# EAGLE design Subsystem (EAGLE 7.6.0)
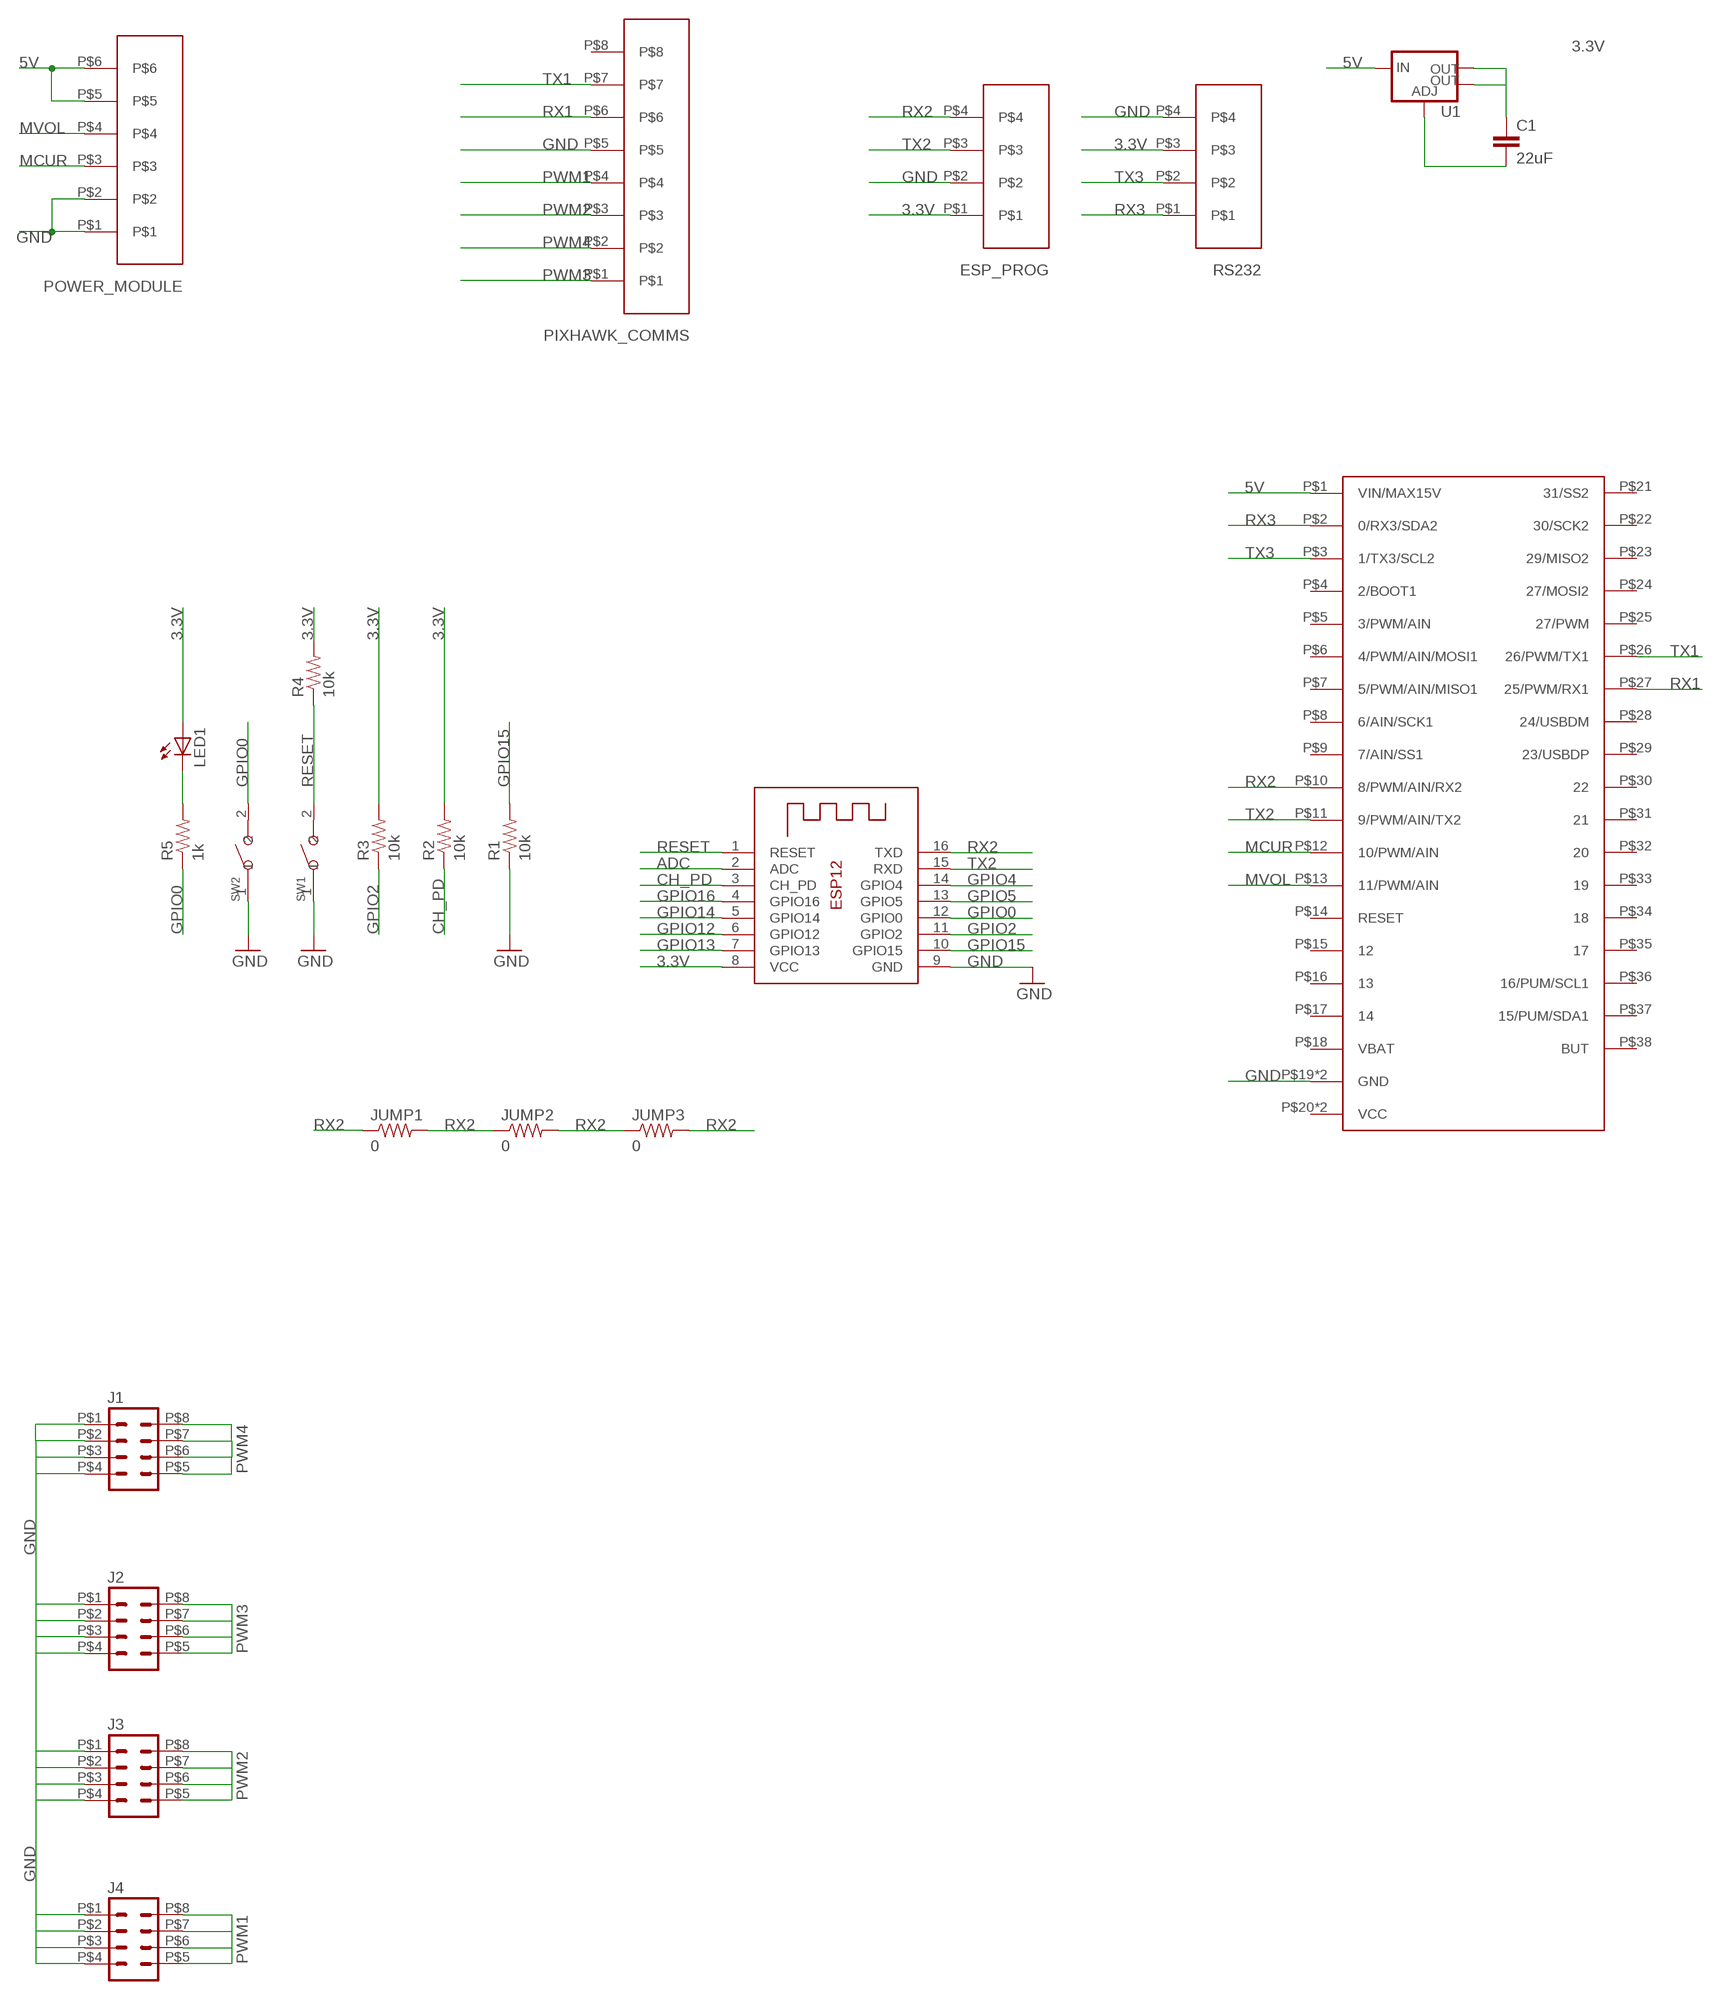
[diagram p0: schematic, sheet 1]

## Parts
C1  22uF  CAP0805  [0805]
ESP_PROG  4PIN-PLUG  [4PIN-PLUG]
J1  M04X2  [2X4]
J2  M04X2  [2X4]
J3  M04X2  [2X4]
J4  M04X2  [2X4]
JUMP1  0  RESISTOR1206  [1206]
JUMP2  0  RESISTOR1206  [1206]
JUMP3  0  RESISTOR1206  [1206]
LED1  LED1206  [LED-1206]
PIXHAWK_COMMS  8PIN-PLUG  [8PIN-PLUG]
POWER_MODULE  6PIN-PLUG  [6PIN-PLUG]
R1  10k  RESISTOR0805-RES  [0805]
R2  10k  RESISTOR0805-RES  [0805]
R3  10k  RESISTOR0805-RES  [0805]
R4  10k  RESISTOR0805-RES  [0805]
R5  1k  RESISTOR0805-RES  [0805]
RS232  4PIN-PLUG  [4PIN-PLUG]
SW1  SMD-BUTTON(2P-6.0X3.0X2.5MM)-DHT-1163S  [SW2-4.0-6.0X3.0X2.5MM]
SW2  SMD-BUTTON(2P-6.0X3.0X2.5MM)-DHT-1163S  [SW2-4.0-6.0X3.0X2.5MM]
U1  V_REG_LM1117SOT223  [SOT223]
U$1  MAPLE-MINI  [MAPLE-MINI]
X1  ESP-12  [ESP-12]

## Nets
3.3V: C1.1 ESP_PROG.P$1 LED1.A R2.2 R3.2 R4.2 RS232.P$3 U1.2(OUT) U1.4(OUT) X1.8(VCC)
5V: POWER_MODULE.P$5 POWER_MODULE.P$6 U1.3(IN) U$1.P$1(VIN/MAX15V)
ADC: X1.2(ADC)
CH_PD: R2.1 X1.3(CH_PD)
GND: C1.2 ESP_PROG.P$2 J1.P$1 J1.P$2 J1.P$3 J1.P$4 J2.P$1 J2.P$2 J2.P$3 J2.P$4 J3.P$1 J3.P$2 J3.P$3 J3.P$4 J4.P$1 J4.P$2 J4.P$3 J4.P$4 PIXHAWK_COMMS.P$5 POWER_MODULE.P$1 POWER_MODULE.P$2 R1.1 RS232.P$4 SW1.1 SW2.1 U1.1(ADJ) U$1.P$19(GND) U$1.P$39(GND) X1.9(GND)
GPIO0: R5.1 SW2.2 X1.12(GPIO0)
GPIO2: R3.1 X1.11(GPIO2)
GPIO4: X1.14(GPIO4)
GPIO5: X1.13(GPIO5)
GPIO12: X1.6(GPIO12)
GPIO13: X1.7(GPIO13)
GPIO14: X1.5(GPIO14)
GPIO15: R1.2 X1.10(GPIO15)
GPIO16: X1.4(GPIO16)
MCUR: POWER_MODULE.P$3 U$1.P$12(10/PWM/AIN)
MVOL: POWER_MODULE.P$4 U$1.P$13(11/PWM/AIN)
N$4: LED1.C R5.2
PWM1: J4.P$5 J4.P$6 J4.P$7 J4.P$8 PIXHAWK_COMMS.P$4
PWM2: J3.P$5 J3.P$6 J3.P$7 J3.P$8 PIXHAWK_COMMS.P$3
PWM3: J2.P$5 J2.P$6 J2.P$7 J2.P$8 PIXHAWK_COMMS.P$1
PWM4: J1.P$5 J1.P$6 J1.P$7 J1.P$8 PIXHAWK_COMMS.P$2
RESET: R4.1 SW1.2 X1.1(RESET)
RX1: PIXHAWK_COMMS.P$6 U$1.P$27(25/PWM/RX1)
RX2: ESP_PROG.P$4 JUMP1.1 JUMP1.2 JUMP2.1 JUMP2.2 JUMP3.1 JUMP3.2 U$1.P$10(8/PWM/AIN/RX2) X1.16(TXD)
RX3: RS232.P$1 U$1.P$2(0/RX3/SDA2)
TX1: PIXHAWK_COMMS.P$7 U$1.P$26(26/PWM/TX1)
TX2: ESP_PROG.P$3 U$1.P$11(9/PWM/AIN/TX2) X1.15(RXD)
TX3: RS232.P$2 U$1.P$3(1/TX3/SCL2)
Unconnected: PIXHAWK_COMMS.P$8 U$1.P$4(2/BOOT1) U$1.P$5(3/PWM/AIN) U$1.P$6(4/PWM/AIN/MOSI1) U$1.P$7(5/PWM/AIN/MISO1) U$1.P$8(6/AIN/SCK1) U$1.P$9(7/AIN/SS1) U$1.P$14(RESET) U$1.P$15 U$1.P$16 U$1.P$17 U$1.P$18(VBAT) U$1.P$20(VCC) U$1.P$21(31/SS2) U$1.P$22(30/SCK2) U$1.P$23(29/MISO2) U$1.P$24(27/MOSI2) U$1.P$25(27/PWM) U$1.P$28(24/USBDM) U$1.P$29(23/USBDP) U$1.P$30 U$1.P$31 U$1.P$32 U$1.P$33 U$1.P$34 U$1.P$35 U$1.P$36(16/PUM/SCL1) U$1.P$37(15/PUM/SDA1) U$1.P$38(BUT) U$1.P$40(VCC)

## Library data of the parts
C1 = Brendan:CAP: Capacitor Standard 0603 ceramic capacitor, and 0.1" leaded capacitor.
ESP_PROG RS232 = Brendan:4PIN-PLUG
J1-J4 = Brendan:M04X2: .1" header, two rows of four.
JUMP1-JUMP3 R1-R5 = Brendan:RESISTOR: Resistor Basic schematic elements and footprints for 0603, 1206, and PTH resistors.
LED1 = Brendan:LED: LEDs Standard schematic elements and footprints for 5mm, 3mm, 1206, and 0603 sized LEDs. 5mm - Spark Fun Electronics SKU : Comp-SBL
PIXHAWK_COMMS = Brendan:8PIN-PLUG
POWER_MODULE = Brendan:6PIN-PLUG
SW1 SW2 = Brendan:SMD-BUTTON(2P-6.0X3.0X2.5MM): 311020029
U1 = Brendan:V_REG_LM1117: Voltage Regulator LM1117 Standard adjustable voltage regulator but in SMD form. Spark Fun Electronics SKU : COM-00595; PROD_ID: VREG-08170
U$1 = Brendan:MAPLE-MINI
X1 = Brendan:ESP-12

## Board
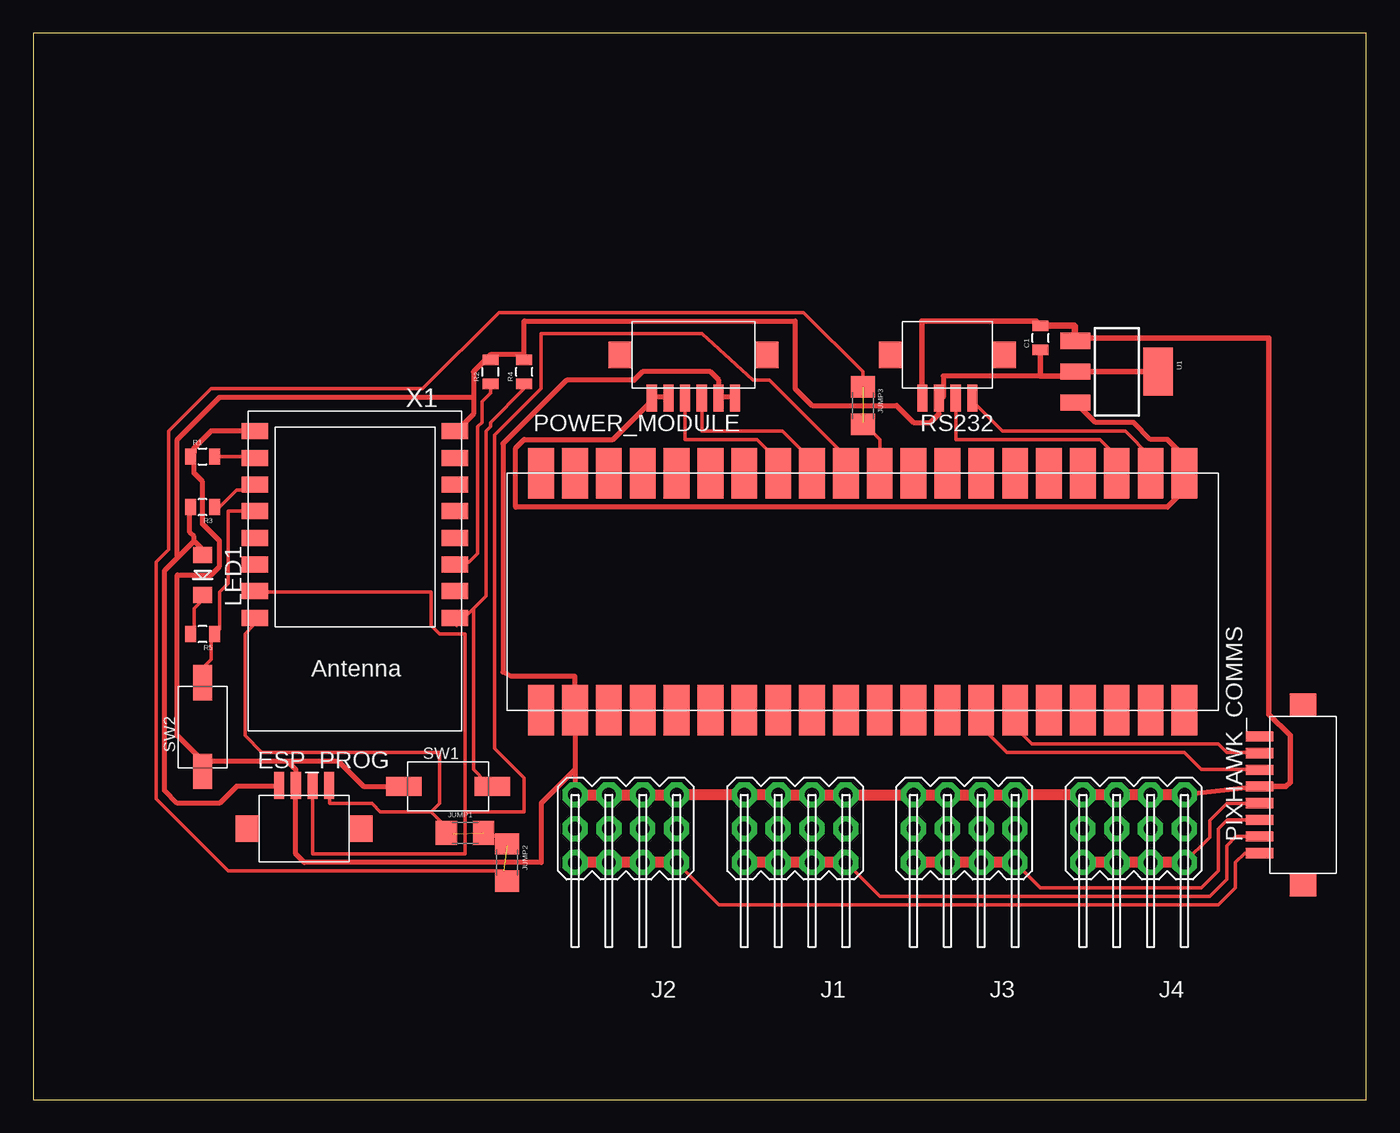
[diagram p1: board, top side]

Size 100 x 80 mm. Coordinates in mm from the lower left corner, seen from the top.
Outline: 0,0 100,0 100,80 0,80 0,0
Copper layers (1*16): Top 0.035mm / dielectric 1.5mm / Bottom 0.035mm
Design rules "default *": minimum track width 10mil, minimum drill 24mil, track to track 11mil, track to pad 11mil, pad to pad 11mil, via to via 11mil, smd to smd 8mil, copper to edge 40mil, drill to drill 8mil, minimum pad ring 10mil, minimum via ring 8mil, stop-mask expansion 4mil, vias tented up to drill 0mil, thermal gap 10mil

### Footprints (pad centres in the part's own frame; a part is rotated, then mirrored left to right if it is on the bottom)
0805 = smd 0.8 x 1.2: 1 -0.9,0; 2 0.9,0
4PIN-PLUG = smd 0.762 x 2.032: P$1 -1.875,3.25; P$2 -0.625,3.25; P$3 0.625,3.25; P$4 1.875,3.25 | smd 1.75 x 2: P$5 4.25,0; P$6 -4.25,0
2X4 = drill 1.016 pad 1.88 octagon: 10 -1.27,-2.54; 12 3.81,-2.54; 35 1.27,-2.54; A -3.81,0; B -1.27,0; C 1.27,0; D 3.81,0; P$1 -3.81,-2.54; P$2 -1.27,-2.54; P$3 1.27,-2.54; P$4 3.81,-2.54; P$5 3.81,2.54; P$6 1.27,2.54; P$7 -1.27,2.54; P$8 -3.81,2.54; Q -3.81,-2.54
1206 = smd 1.6 x 1.8: 1 -1.4,0; 2 1.4,0
LED-1206 = smd 1.2 x 1.4: A -1.5,0; C 1.5,0
8PIN-PLUG = smd 0.762 x 2.032: P$1 -4.375,3.25; P$2 -3.125,3.25; P$3 -1.875,3.25; P$4 -0.625,3.25; P$5 0.625,3.25; P$6 1.875,3.25; P$7 3.125,3.25; P$8 4.375,3.25 | smd 1.75 x 2: P$9 6.75,0; P$10 -6.75,0
6PIN-PLUG = smd 0.762 x 2.032: P$1 -3.125,3.25; P$2 -1.875,3.25; P$3 -0.625,3.25; P$4 0.625,3.25; P$5 1.875,3.25; P$6 3.125,3.25 | smd 1.75 x 2: P$7 5.5,0; P$8 -5.5,0
SW2-4.0-6.0X3.0X2.5MM = smd 2.65 x 1.4: 1 -3.325,0; 2 3.325,0
SOT223 = smd 1.219 x 2.235: 1 -2.311,-3.099; 2 0,-3.099; 3 2.311,-3.099 | smd 3.6 x 2.2: 4 0,3.099
MAPLE-MINI = smd 3.81 x 1.93: P$1 -8.89,24.13; P$2 -8.89,21.59; P$3 -8.89,19.05; P$4 -8.89,16.51; P$5 -8.89,13.97; P$6 -8.89,11.43; P$7 -8.89,8.89; P$8 -8.89,6.35; P$9 -8.89,3.81; P$10 -8.89,1.27; P$11 -8.89,-1.27; P$12 -8.89,-3.81; P$13 -8.89,-6.35; P$14 -8.89,-8.89; P$15 -8.89,-11.43; P$16 -8.89,-13.97; P$17 -8.89,-16.51; P$18 -8.89,-19.05; P$19 -8.89,-21.59; P$20 -8.89,-24.13; P$21 8.89,24.13; P$22 8.89,21.59; P$23 8.89,19.05; P$24 8.89,16.51; P$25 8.89,13.97; P$26 8.89,11.43; P$27 8.89,8.89; P$28 8.89,6.35; P$29 8.89,3.81; P$30 8.89,1.27; P$31 8.89,-1.27; P$32 8.89,-3.81; P$33 8.89,-6.35; P$34 8.89,-8.89; P$35 8.89,-11.43; P$36 8.89,-13.97; P$37 8.89,-16.51; P$38 8.89,-19.05; P$39 8.89,-21.59; P$40 8.89,-24.13
ESP-12 = smd 2 x 1.2: 1 -7.5,4.5; 2 -7.5,2.5; 3 -7.5,0.5; 4 -7.5,-1.5; 5 -7.5,-3.5; 6 -7.5,-5.5; 7 -7.5,-7.5; 8 -7.5,-9.5; 9 7.5,-9.5; 10 7.5,-7.5; 11 7.5,-5.5; 12 7.5,-3.5; 13 7.5,-1.5; 14 7.5,0.5; 15 7.5,2.5; 16 7.5,4.5

### Placement (x,y rotation side)
C1  75.56,57.15 90 top
ESP_PROG  20.32,20.32 0 top
J1  57.15,20.32 180 top
J2  44.45,20.32 180 top
J3  69.85,20.32 180 top
J4  82.55,20.32 180 top
JUMP1  32.38,20 0 top
JUMP2  35.56,17.78 270 top
JUMP3  62.23,52.07 270 top
LED1  12.7,39.37 270 top
PIXHAWK_COMMS  95.25,22.86 90 top
POWER_MODULE  49.53,55.88 180 top
R1  12.7,48.26 0 top
R2  34.29,54.61 90 top
R3  12.7,44.45 180 top
R4  36.83,54.61 90 top
R5  12.7,34.92 180 top
RS232  68.58,55.88 180 top
SW1  31.11,23.5 0 top
SW2  12.7,27.94 90 top
U1  81.28,54.61 270 top
U$1  62.23,38.1 270 top
X1  24.13,40.64 180 top

### Tracks (layer width: path | path; a pad name or v marks a point on that pad's centre or on a via)
3.3V
  Top 0.381: U1.2 78.11,54.61 77.79,54.29 75.56,54.29 68.26,54.29 68.26,52.7 RS232.P$3 67.94,52.07 67.94,51.44 67.31,50.8 66.04,50.8 64.77,52.07 58.42,52.07 57.15,53.34 57.15,58.42 36.83,58.42 36.83,55.88 | 36.83,55.88 34.29,55.88 | 33.02,52.7 33.02,54.61 34.29,55.88 | 33.02,52.7 33.02,51.44 31.75,50.16 X1.8 | 34.29,55.88 R2.2 | 12.06,41.91 12.7,41.27 LED1.A | 12.06,41.91 10.79,40.64 | 10.79,40.64 9.84,39.69 9.84,23.18 10.79,22.23 13.97,22.23 15.24,23.5 18.41,23.5 ESP_PROG.P$1 | 36.83,55.88 R4.2 | 10.79,40.64 10.79,49.53 13.97,52.7 33.02,52.7 | 12.06,41.91 12.06,42.23 11.75,42.55 11.75,44.4 R3.2
  Top 0.406: U1.2 U1.4 | C1.1 75.56,54.29 77.47,54.29 | 77.79,54.29 77.47,54.29 | 77.47,54.29 77.47,54.61
5V
  Top 0.381: POWER_MODULE.P$5 47.62,52.7 46.35,52.7 POWER_MODULE.P$6 46.35,52.39 43.5,49.53 36.83,49.53 36.2,48.9 36.2,44.45 85.09,44.45 86.36,45.72 U$1.P$1 86.36,48.26 85.09,49.53 83.82,49.53 82.55,50.8 79.69,50.8 78.42,52.07 U1.3
CH_PD
  Top 0.254: R2.1 34.29,53.02 33.66,52.39 33.66,50.8 33.34,50.48 33.34,40.96 32.7,40.32 31.81,40.32 X1.3
GND
  Top 0.381: PIXHAWK_COMMS.P$5 J4.P$1 | 40.64,24.77 U$1.P$39 40.64,31.75 35.88,31.75 35.24,32.07 35.24,49.21 40.01,53.98 45.09,53.98 45.72,54.61 50.8,54.61 51.44,53.98 51.44,52.7 | 40.64,24.77 J2.P$4 | X1.9 16.51,50.16 13.34,50.16 12.06,48.9 12.06,48.52 R1.1 | 19.05,25.4 19.68,24.77 19.68,24.13 ESP_PROG.P$2 19.68,23.5 19.68,18.41 20.32,17.78 38.1,17.78 38.1,22.23 40.64,24.77 | 12.7,25.4 19.05,25.4 | 19.05,25.4 22.86,25.4 24.77,23.5 SW1.1 | 12.7,25.4 10.79,27.3 10.79,39.37 13.34,39.37 13.97,40.01 13.97,41.91 12.7,43.18 12.7,46.35 12.06,46.99 12.06,47.99 R1.1 | 12.06,48.26 R1.1 | 12.7,25.4 SW2.1 | 66.67,52.7 RS232.P$4 | 51.44,52.7 52.7,52.7 POWER_MODULE.P$1 | 51.44,52.7 POWER_MODULE.P$2 | 66.67,58.42 75.19,58.42
  Top 0.406: 75.19,58.42 75.19,58.05 C1.2 78.18,58.05 U1.1 | 66.67,52.7 66.67,58.42 75.25,58.42 75.25,58.1 78.11,58.1 78.11,57.15 92.71,57.15 92.71,28.89 94.3,27.3 94.3,23.81 93.98,23.5 92.01,23.5 PIXHAWK_COMMS.P$5
  Top 0.813: J4.P$1 J4.P$2 J4.P$3 J4.P$4 J3.P$1 J3.P$2 J3.P$3 J3.P$4 J1.P$1 J1.P$2 J1.P$3 J1.P$4 J2.P$1 J2.P$2 J2.P$3 J2.P$4
  cutout Top (isolate 0.61): 7.94,59.69 7.94,13.02 96.52,13.34 96.52,59.69
GPIO0
  Top 0.254: 13.34,34.92 R5.1 | X1.12 14.61,44.14 14.61,38.73 13.97,38.1 13.97,35.3 R5.1 | SW2.2 12.7,32.38 13.34,33.02 13.34,34.66 R5.1
GPIO2
  Top 0.254: R3.1 13.97,44.45 15.24,45.72 16.51,45.72 X1.11
GPIO15
  Top 0.254: R1.2 16.51,48.26 X1.10
MCUR
  Top 0.254: U$1.P$12 58.42,47.94 56.2,50.16 50.16,50.16 50.16,52.39 POWER_MODULE.P$3
MVOL
  Top 0.254: U$1.P$13 55.88,47.94 54.29,49.53 48.9,49.53 48.9,52.39 POWER_MODULE.P$4
N$1
  Top 0.406: 78.74,57.15 92.71,57.15 92.71,28.89 94.3,27.3 94.3,23.81 93.98,23.5 92.08,23.5
N$4
  Top 0.254: 12.06,34.92 R5.2 12.06,35.19 12.06,36.83 12.7,37.47 LED1.C
PWM1
  Top 0.254: PIXHAWK_COMMS.P$4 89.55,22.23 88.27,20.95 88.27,19.68 J4.P$8
  Top 0.813: J4.P$8 J4.P$7 J4.P$6 J4.P$5
PWM2
  Top 0.254: PIXHAWK_COMMS.P$3 89.56,20.98 88.9,20.32 88.9,17.14 87.63,15.88 75.56,15.88 J3.P$8
  Top 0.813: J3.P$8 J3.P$7 J3.P$6 J3.P$5
PWM3
  Top 0.254: PIXHAWK_COMMS.P$1 90.88,18.48 90.17,17.78 90.17,15.88 88.9,14.61 51.44,14.61 J2.P$8
  Top 0.813: J2.P$8 J2.P$7 J2.P$6 J2.P$5
PWM4
  Top 0.254: PIXHAWK_COMMS.P$2 90.22,19.73 89.53,19.05 89.53,16.51 88.27,15.24 63.5,15.24 J1.P$8
  Top 0.813: J1.P$8 J1.P$7 J1.P$6 J1.P$5
RESET
  Top 0.254: 33.02,36.83 31.75,35.56 X1.1 | R4.1 36.83,53.34 34.29,50.8 34.29,50.48 33.97,50.16 33.97,37.78 33.02,36.83 | 33.02,36.83 33.02,24.77 33.97,23.81 34.12,23.81 SW1.2
RX1
  Top 0.254: U$1.P$27 71.12,27.94 73.03,26.04 86.36,26.04 87.63,24.77 91.44,24.77 PIXHAWK_COMMS.P$6
RX2  (3 unrouted)
  Top 0.254: 29.84,21.59 30.48,22.23 30.48,26.04 17.14,26.04 15.88,27.3 15.88,34.92 16.51,35.56 X1.16 | 29.84,21.59 26.04,21.59 25.4,22.23 22.23,22.23 22.23,23.5 ESP_PROG.P$4 | JUMP3.2 62.23,50.8 63.5,49.53 U$1.P$10 | JUMP1.1 31.48,19.95 29.84,21.59 | JUMP2.1 35.56,19.05 34.92,19.68 JUMP1.2 | JUMP3.1 62.23,54.61 57.78,59.05 34.92,59.05 29.21,53.34 13.34,53.34 10.16,50.16 10.16,41.27 9.21,40.32 9.21,22.54 14.61,17.14 35.3,17.14 JUMP2.2
RX3
  Top 0.254: U$1.P$2 83.82,48.26 81.92,50.16 72.71,50.16 70.48,52.39 RS232.P$1
TX1
  Top 0.254: U$1.P$26 73.66,27.94 74.93,26.67 88.9,26.67 89.53,26.04 91.44,26.04 PIXHAWK_COMMS.P$7
TX2
  Top 0.254: 32.38,21.59 32.38,18.41 20.95,18.41 20.95,23.5 ESP_PROG.P$3 | 32.38,21.59 32.38,34.92 30.48,34.92 29.84,35.56 29.84,38.1 17.14,38.1 X1.15 | U$1.P$11 60.33,47.62 60.33,48.9 55.24,53.98 53.98,53.98 50.16,57.47 38.1,57.47 38.1,53.34 34.61,49.85 34.61,26.35 36.83,24.13 36.83,21.59 32.38,21.59
TX3
  Top 0.254: U$1.P$3 81.28,48.26 80.01,49.53 69.22,49.53 69.22,52.39 RS232.P$2